# EAGLE schematic Wiazka_Woltomierz (EAGLE 8.6.0)
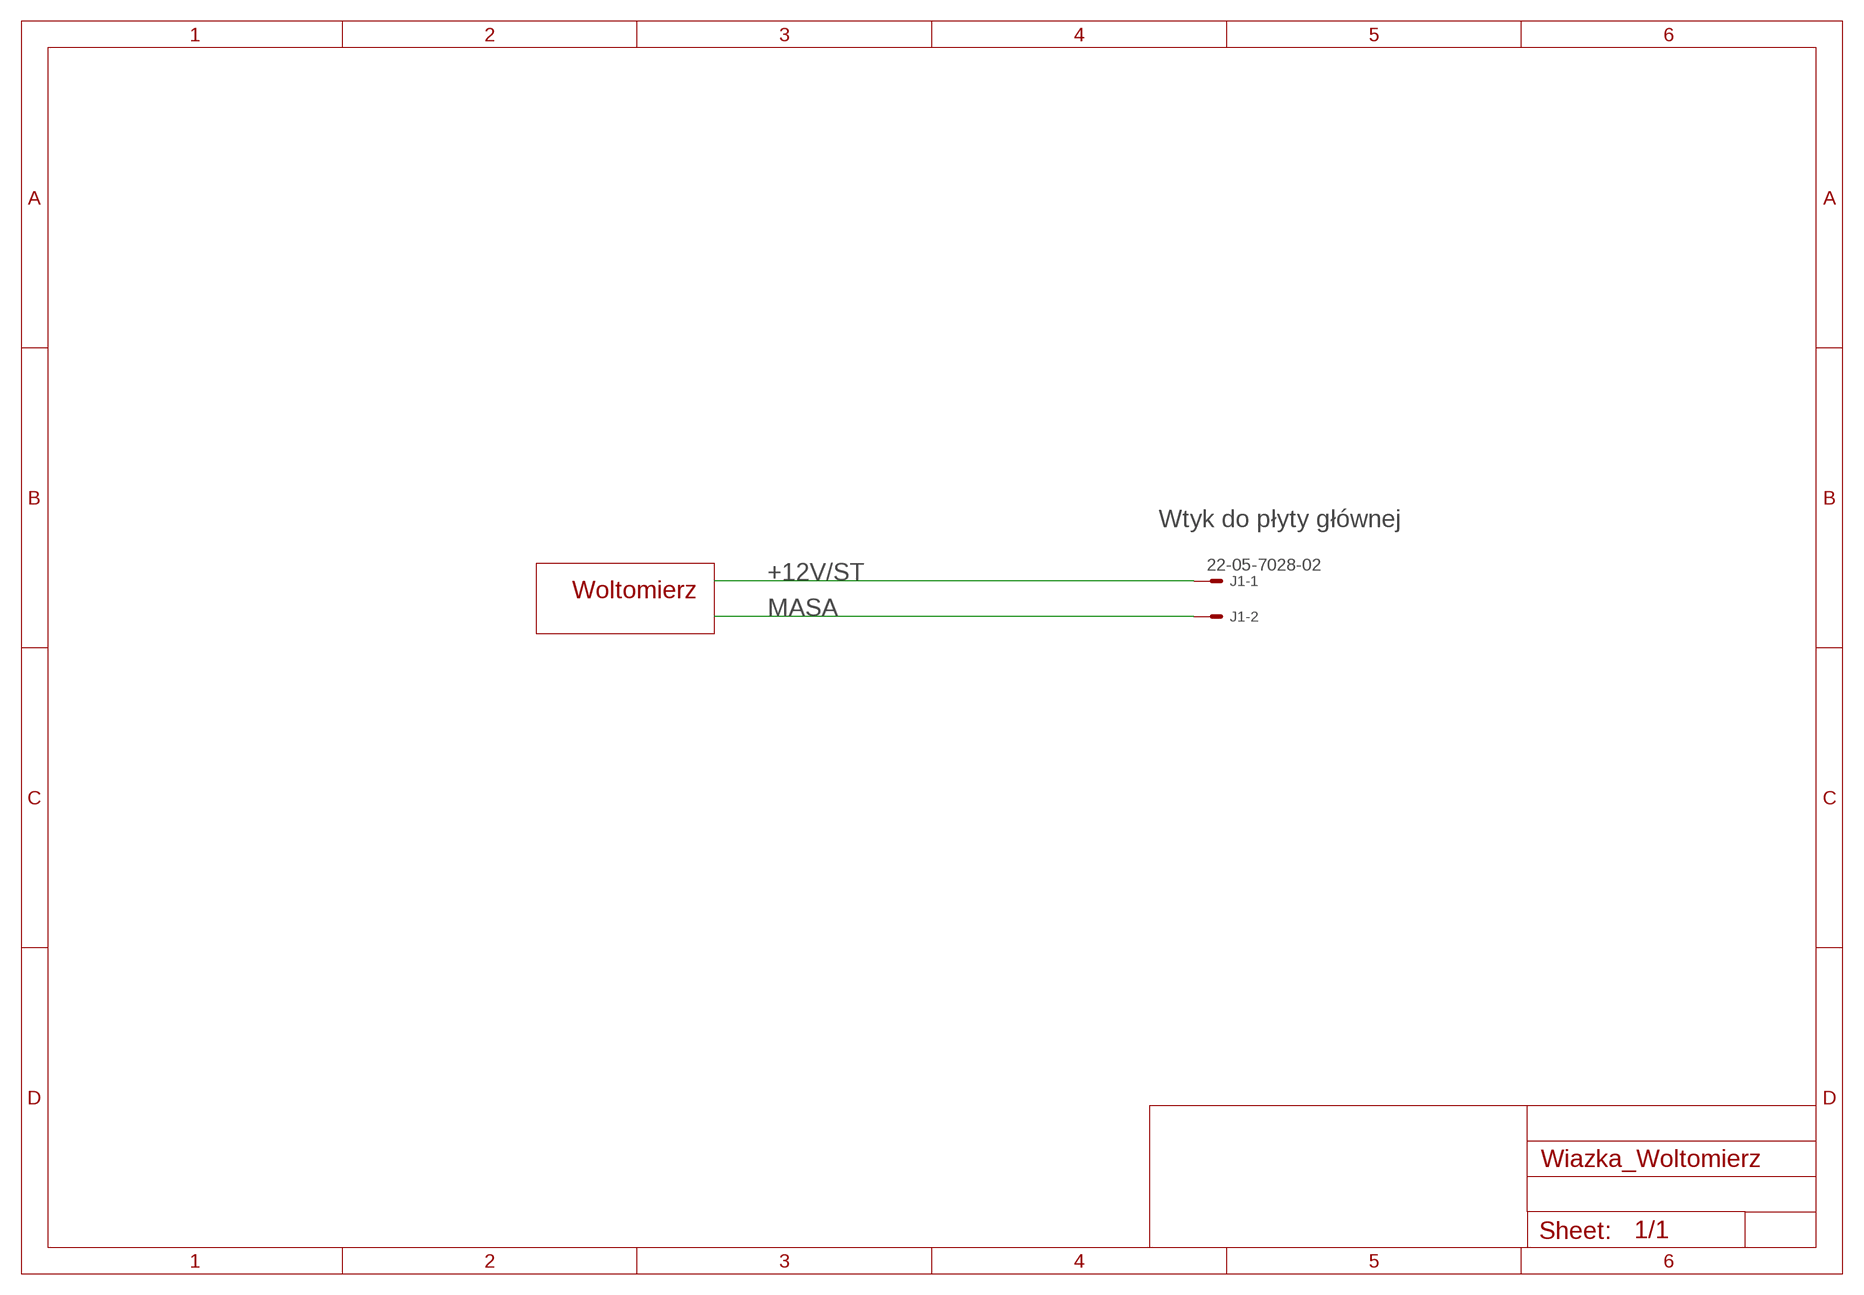
[diagram p0: schematic, sheet 1]

## Parts
J1  22-05-7028-02  [7395-02]

## Nets
+12V/ST: J1.1
MASA: J1.2

## Notes on the sheet
- Wtyk do płyty głównej
- Woltomierz

## Library data of the parts
J1 = con-molex:22-?-02: CONNECTOR wire to board 2.54 mm (.1 inch) pitch header; MF: MOLEX; OC_FARNELL: 9731601; OC_NEWARK: unknown